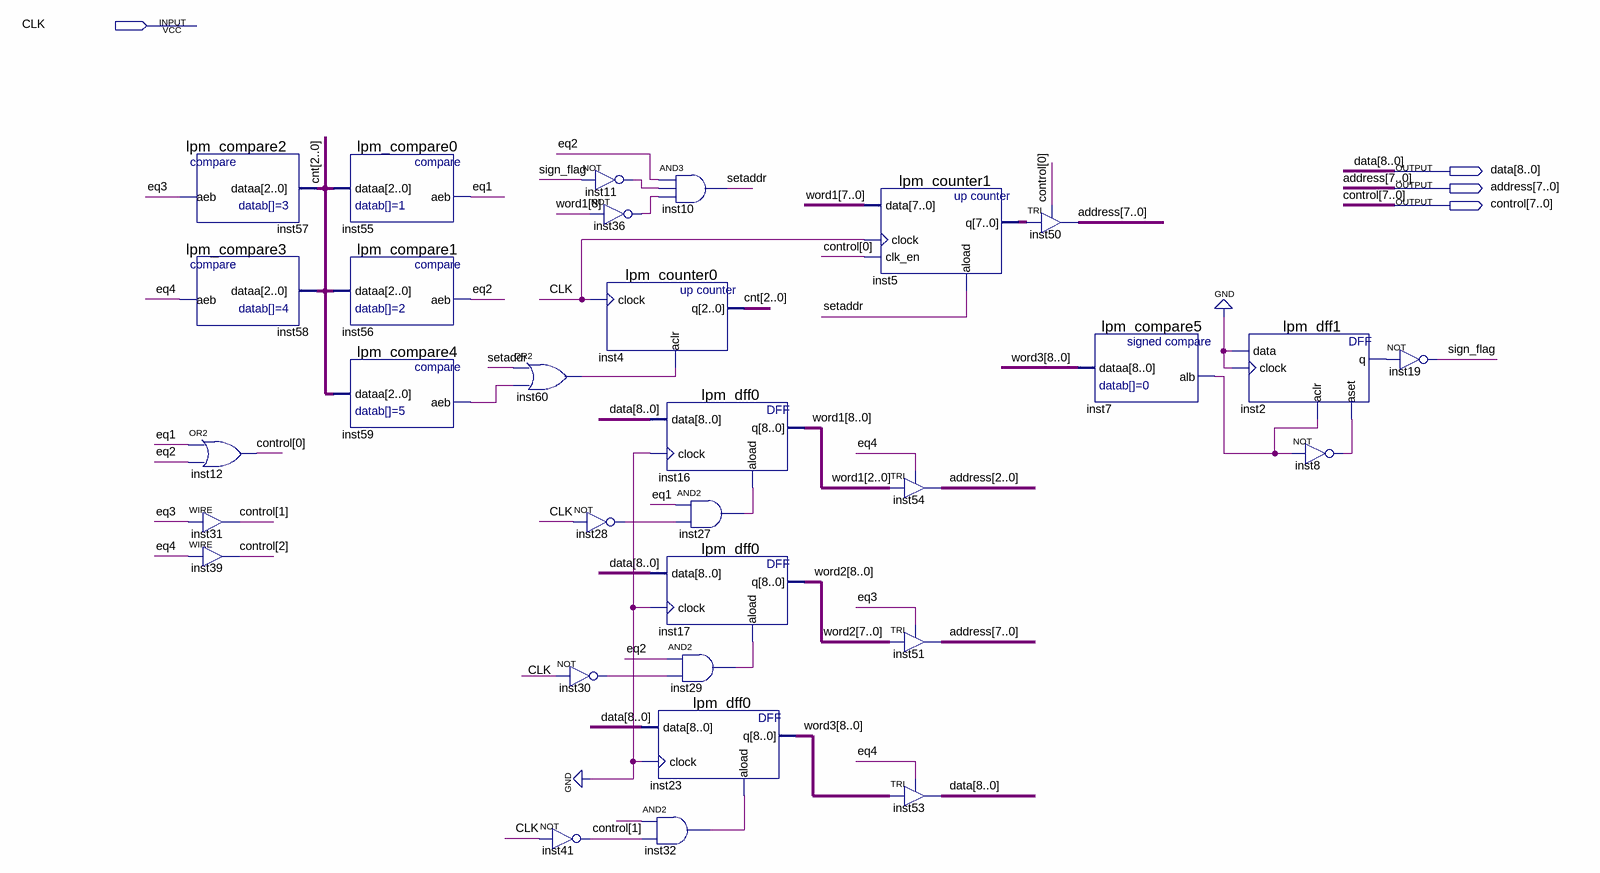
[diagram p0: schematic sheet]
// Quartus schematic control_unit.bdf as structural Verilog: 31 symbols, 4 pins
module control_unit (
  input  CLK,
  output [8:0] data,
  output [7:0] address,
  output [7:0] control
);

  wire eq1, eq2, eq3, eq4, inst2_q, inst7_alb, inst8_out, inst11_out, inst27_out, inst28_out, inst29_out,
       inst30_out, inst32_out, inst36_out, inst41_out, inst59_aeb, inst60_out, setaddr, sign_flag;
  wire [2:0] cnt;
  wire [7:0] inst5_q;
  wire [8:0] word1, word2, word3;

  lpm_compare2 inst57 (.dataa(cnt), .aeb(eq3));
  lpm_compare3 inst58 (.dataa(cnt), .aeb(eq4));
  or inst12 (control[0], eq1, eq2);
  assign control[1] = eq3;  // WIRE inst31
  assign control[2] = eq4;  // WIRE inst39
  lpm_compare0 inst55 (.dataa(cnt), .aeb(eq1));
  lpm_compare1 inst56 (.dataa(cnt), .aeb(eq2));
  lpm_compare4 inst59 (.dataa(cnt), .aeb(inst59_aeb));
  or inst60 (inst60_out, setaddr, inst59_aeb);
  not inst30 (inst30_out, CLK);
  not inst41 (inst41_out, CLK);
  not inst11 (inst11_out, sign_flag);
  not inst36 (inst36_out, word1[8]);
  lpm_counter0 inst4 (.clock(CLK), .aclr(inst60_out), .q(cnt));
  not inst28 (inst28_out, CLK);
  and inst10 (setaddr, eq2, inst11_out, inst36_out);
  lpm_dff0 inst16 (.data(data), .clock(1'b0), .aload(inst27_out), .q(word1));
  and inst27 (inst27_out, eq1, inst28_out);
  lpm_dff0 inst17 (.data(data), .clock(1'b0), .aload(inst29_out), .q(word2));
  and inst29 (inst29_out, eq2, inst30_out);
  lpm_dff0 inst23 (.data(data), .clock(1'b0), .aload(inst32_out), .q(word3));
  and inst32 (inst32_out, control[1], inst41_out);
  lpm_counter1 inst5 (.data(word1[7:0]), .clock(CLK), .clk_en(control[0]), .aload(setaddr), .q(inst5_q));
  TRI inst54[2:0] (.IN(word1[2:0]), .OE(eq4), .OUT(address[2:0]));
  TRI inst51[7:0] (.IN(word2[7:0]), .OE(eq3), .OUT(address));
  TRI inst53[8:0] (.IN(word3), .OE(eq4), .OUT(data));
  TRI inst50[7:0] (.IN(inst5_q), .OE(control[0]), .OUT(address));
  lpm_compare5 inst7 (.dataa(word3), .alb(inst7_alb));
  lpm_dff1 inst2 (.data(1'b0), .clock(1'b0), .aclr(inst7_alb), .aset(inst8_out), .q(inst2_q));
  not inst8 (inst8_out, inst7_alb);
  not inst19 (sign_flag, inst2_q);
endmodule
